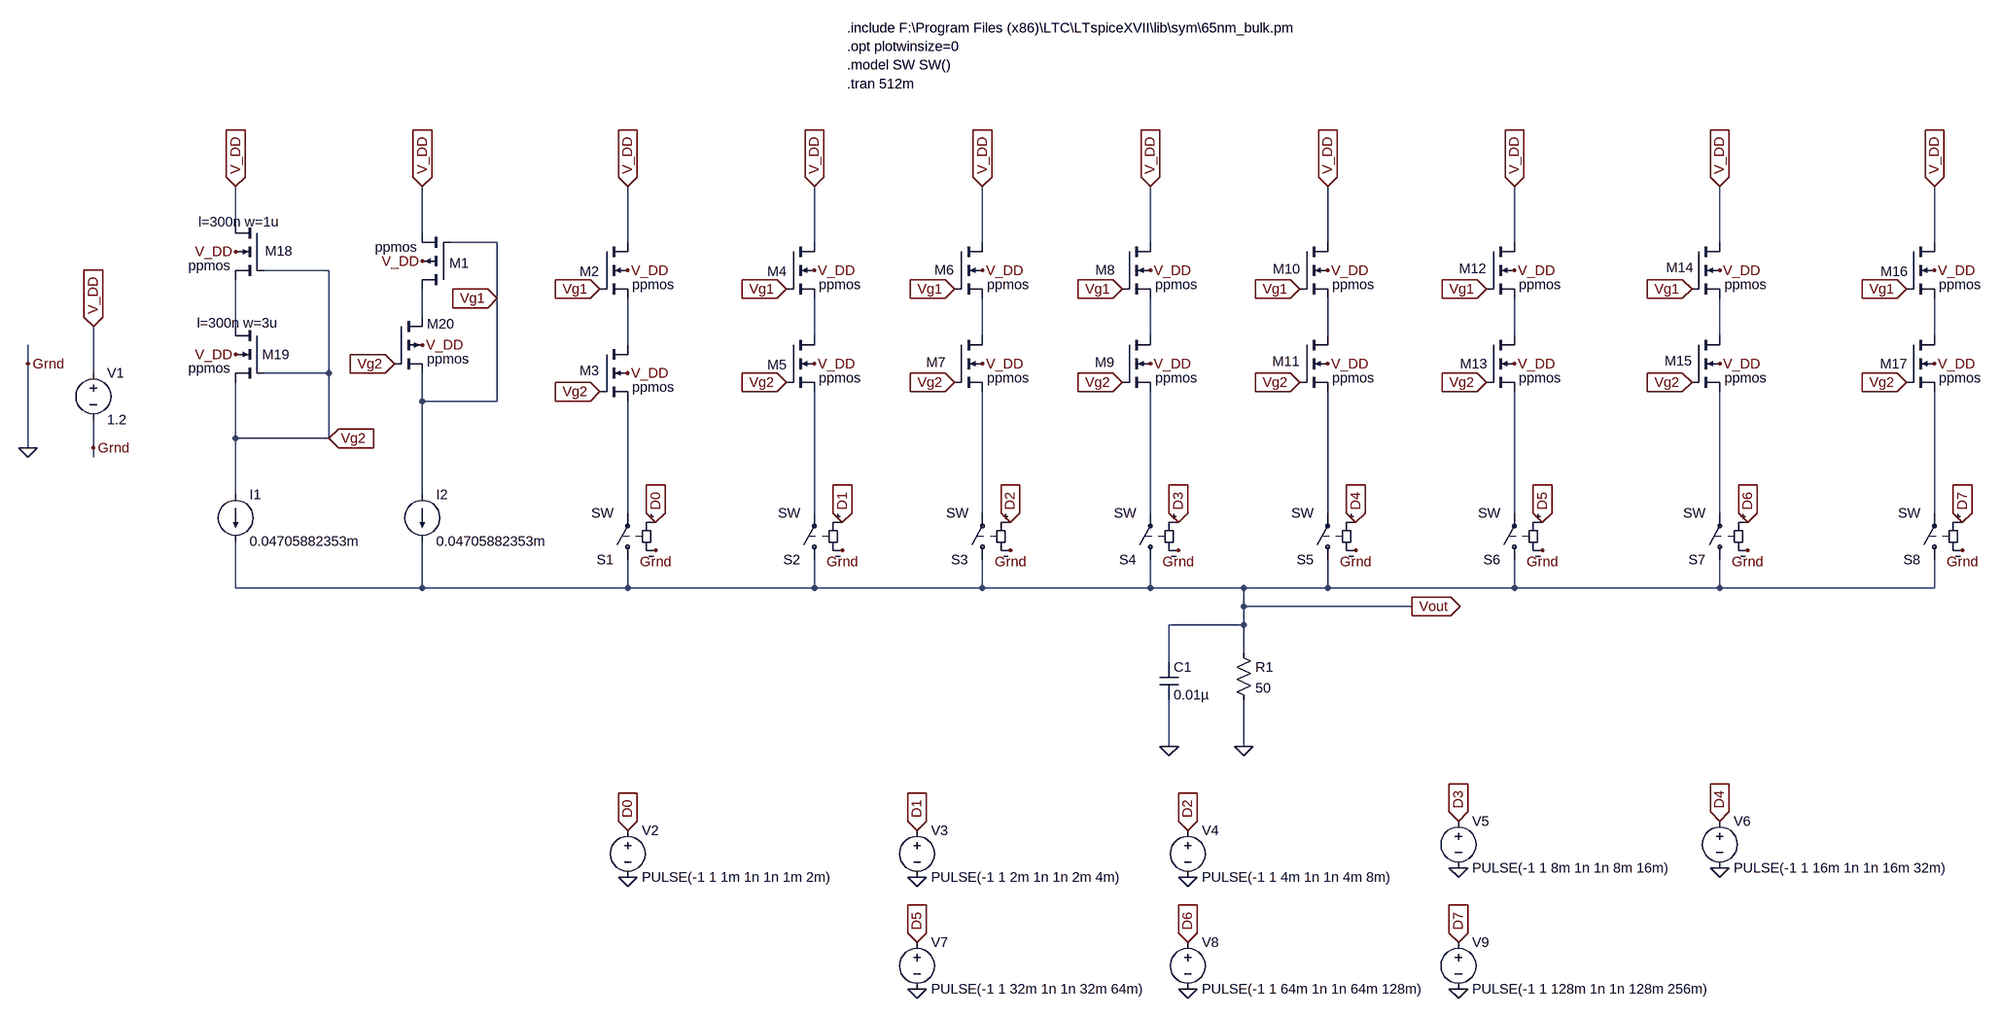
[diagram p0: schematic DAC_Sooch_Cascode_PMOS.asc]
DAC_Sooch_Cascode_PMOS.asc, the LTspice schematic file:
Version 4
SHEET 1 1724 868
WIRE -1328 -464 -1328 -528
WIRE -1008 -448 -1008 -528
WIRE -880 -432 -960 -432
WIRE -656 -432 -656 -528
WIRE -336 -432 -336 -528
WIRE -48 -432 -48 -528
WIRE 240 -432 240 -528
WIRE 544 -432 544 -528
WIRE 864 -432 864 -528
WIRE 1216 -432 1216 -528
WIRE 1584 -432 1584 -528
WIRE -1168 -384 -1280 -384
WIRE -880 -336 -880 -432
WIRE -1008 -304 -1008 -352
WIRE -1328 -288 -1328 -368
WIRE -336 -272 -336 -336
WIRE -48 -272 -48 -336
WIRE 240 -272 240 -336
WIRE 544 -272 544 -336
WIRE 864 -272 864 -336
WIRE 1216 -272 1216 -336
WIRE 1584 -272 1584 -336
WIRE -656 -256 -656 -336
WIRE -1824 -224 -1824 -256
WIRE -1712 -208 -1712 -288
WIRE -1168 -208 -1168 -384
WIRE -1168 -208 -1280 -208
WIRE -1008 -160 -1008 -208
WIRE -880 -160 -880 -336
WIRE -880 -160 -1008 -160
WIRE -1328 -96 -1328 -192
WIRE -1168 -96 -1168 -208
WIRE -1168 -96 -1328 -96
WIRE -1824 -80 -1824 -224
WIRE -1712 -80 -1712 -128
WIRE -1712 -64 -1712 -80
WIRE -1328 0 -1328 -96
WIRE -1008 0 -1008 -160
WIRE -656 32 -656 -160
WIRE -336 32 -336 -176
WIRE -48 32 -48 -176
WIRE 240 32 240 -176
WIRE 544 32 544 -176
WIRE 864 32 864 -176
WIRE 1216 32 1216 -176
WIRE 1584 32 1584 -176
WIRE -1328 160 -1328 80
WIRE -1008 160 -1008 80
WIRE -1008 160 -1328 160
WIRE -656 160 -656 112
WIRE -656 160 -1008 160
WIRE -336 160 -336 112
WIRE -336 160 -656 160
WIRE -48 160 -48 112
WIRE -48 160 -336 160
WIRE 240 160 240 112
WIRE 240 160 -48 160
WIRE 400 160 240 160
WIRE 544 160 544 112
WIRE 544 160 400 160
WIRE 864 160 864 112
WIRE 864 160 544 160
WIRE 1216 160 1216 112
WIRE 1216 160 864 160
WIRE 1584 160 1584 112
WIRE 1584 160 1216 160
WIRE 400 192 400 160
WIRE 688 192 400 192
WIRE 400 224 400 192
WIRE 400 224 272 224
WIRE 400 272 400 224
WIRE 272 288 272 224
WIRE 272 432 272 352
WIRE 400 432 400 352
FLAG -1824 -80 0
FLAG -1824 -224 Grnd
FLAG -1712 -80 Grnd
FLAG -1712 -288 V_DD
IOPIN -1712 -288 In
FLAG -1328 -528 V_DD
IOPIN -1328 -528 In
FLAG -1008 -528 V_DD
IOPIN -1008 -528 In
FLAG 400 432 0
FLAG 272 432 0
FLAG 688 192 Vout
IOPIN 688 192 Out
FLAG -608 96 Grnd
FLAG -288 96 Grnd
FLAG 0 96 Grnd
FLAG 288 96 Grnd
FLAG 592 96 Grnd
FLAG 912 96 Grnd
FLAG 1264 96 Grnd
FLAG 1632 96 Grnd
FLAG -608 48 D0
IOPIN -608 48 In
FLAG -288 48 D1
IOPIN -288 48 In
FLAG 0 48 D2
IOPIN 0 48 In
FLAG 288 48 D3
IOPIN 288 48 In
FLAG 592 48 D4
IOPIN 592 48 In
FLAG 912 48 D5
IOPIN 912 48 In
FLAG 1264 48 D6
IOPIN 1264 48 In
FLAG 1632 48 D7
IOPIN 1632 48 In
FLAG -656 656 0
FLAG -656 576 D0
IOPIN -656 576 In
FLAG -160 656 0
FLAG -160 576 D1
IOPIN -160 576 In
FLAG 304 656 0
FLAG 304 576 D2
IOPIN 304 576 In
FLAG 768 640 0
FLAG 768 560 D3
IOPIN 768 560 In
FLAG 1216 640 0
FLAG 1216 560 D4
IOPIN 1216 560 In
FLAG -160 848 0
FLAG -160 768 D5
IOPIN -160 768 In
FLAG 304 848 0
FLAG 304 768 D6
IOPIN 304 768 In
FLAG 768 848 0
FLAG 768 768 D7
IOPIN 768 768 In
FLAG -656 -528 V_DD
IOPIN -656 -528 In
FLAG -336 -528 V_DD
IOPIN -336 -528 In
FLAG -48 -528 V_DD
IOPIN -48 -528 In
FLAG 240 -528 V_DD
IOPIN 240 -528 In
FLAG 544 -528 V_DD
IOPIN 544 -528 In
FLAG 864 -528 V_DD
IOPIN 864 -528 In
FLAG 1216 -528 V_DD
IOPIN 1216 -528 In
FLAG 1584 -528 V_DD
IOPIN 1584 -528 In
FLAG -656 -384 V_DD
FLAG -336 -384 V_DD
FLAG -48 -384 V_DD
FLAG 240 -384 V_DD
FLAG 544 -384 V_DD
FLAG 864 -384 V_DD
FLAG -656 -208 V_DD
FLAG -336 -224 V_DD
FLAG -48 -224 V_DD
FLAG 240 -224 V_DD
FLAG 544 -224 V_DD
FLAG 864 -224 V_DD
FLAG -1328 -416 V_DD
FLAG -1328 -240 V_DD
FLAG -704 -352 Vg1
IOPIN -704 -352 In
FLAG -384 -352 Vg1
IOPIN -384 -352 In
FLAG -96 -352 Vg1
IOPIN -96 -352 In
FLAG 192 -352 Vg1
IOPIN 192 -352 In
FLAG 496 -352 Vg1
IOPIN 496 -352 In
FLAG 816 -352 Vg1
IOPIN 816 -352 In
FLAG 1168 -352 Vg1
IOPIN 1168 -352 In
FLAG -704 -176 Vg2
IOPIN -704 -176 In
FLAG -384 -192 Vg2
IOPIN -384 -192 In
FLAG -96 -192 Vg2
IOPIN -96 -192 In
FLAG 192 -192 Vg2
IOPIN 192 -192 In
FLAG 496 -192 Vg2
IOPIN 496 -192 In
FLAG 816 -192 Vg2
IOPIN 816 -192 In
FLAG 1168 -192 Vg2
IOPIN 1168 -192 In
FLAG 1536 -192 Vg2
IOPIN 1536 -192 In
FLAG 1536 -352 Vg1
IOPIN 1536 -352 In
FLAG 1216 -384 V_DD
FLAG 1216 -224 V_DD
FLAG 1584 -224 V_DD
FLAG 1584 -384 V_DD
FLAG -1168 -96 Vg2
IOPIN -1168 -96 In
FLAG -1008 -400 V_DD
FLAG -1008 -256 V_DD
FLAG -880 -336 Vg1
IOPIN -880 -336 In
FLAG -1056 -224 Vg2
IOPIN -1056 -224 In
SYMBOL voltage -1712 -224 R0
WINDOW 123 0 0 Left 0
WINDOW 39 0 0 Left 0
SYMATTR InstName V1
SYMATTR Value 1.2
SYMBOL nmos4 -704 -432 R0
WINDOW 0 -34 50 Left 2
SYMATTR InstName M2
SYMATTR Value ppmos
SYMATTR Value2 l=300n w=3u
SYMBOL nmos4 -704 -256 R0
WINDOW 0 -34 44 Left 2
SYMATTR InstName M3
SYMATTR Value ppmos
SYMATTR Value2 l=300n w=3u
SYMBOL nmos4 -384 -432 R0
WINDOW 0 -33 50 Left 2
SYMATTR InstName M4
SYMATTR Value ppmos
SYMATTR Value2 l=300n w=3u m=2
SYMBOL nmos4 -384 -272 R0
WINDOW 0 -33 50 Left 2
SYMATTR InstName M5
SYMATTR Value ppmos
SYMATTR Value2 l=300n w=3u m=2
SYMBOL nmos4 -96 -432 R0
WINDOW 0 -34 47 Left 2
SYMATTR InstName M6
SYMATTR Value ppmos
SYMATTR Value2 l=300n w=3u m=4
SYMBOL nmos4 -96 -272 R0
WINDOW 0 -48 46 Left 2
SYMATTR InstName M7
SYMATTR Value ppmos
SYMATTR Value2 l=300n w=3u m=4
SYMBOL nmos4 192 -432 R0
WINDOW 0 -46 47 Left 2
SYMATTR InstName M8
SYMATTR Value ppmos
SYMATTR Value2 l=300n w=3u m=8
SYMBOL nmos4 192 -272 R0
WINDOW 0 -47 46 Left 2
SYMATTR InstName M9
SYMATTR Value ppmos
SYMATTR Value2 l=300n w=3u m=8
SYMBOL nmos4 496 -432 R0
WINDOW 0 -46 46 Left 2
SYMATTR InstName M10
SYMATTR Value ppmos
SYMATTR Value2 l=300n w=3u m=16
SYMBOL nmos4 496 -272 R0
WINDOW 0 -47 44 Left 2
SYMATTR InstName M11
SYMATTR Value ppmos
SYMATTR Value2 l=300n w=3u m=16
SYMBOL nmos4 816 -432 R0
WINDOW 0 -47 45 Left 2
SYMATTR InstName M12
SYMATTR Value ppmos
SYMATTR Value2 l=300n w=3u m=32
SYMBOL nmos4 816 -272 R0
WINDOW 0 -45 48 Left 2
SYMATTR InstName M13
SYMATTR Value ppmos
SYMATTR Value2 l=300n w=3u m=32
SYMBOL nmos4 1168 -432 R0
WINDOW 0 -44 43 Left 2
SYMATTR InstName M14
SYMATTR Value ppmos
SYMATTR Value2 l=300n w=3u m=64
SYMBOL nmos4 1168 -272 R0
WINDOW 0 -46 43 Left 2
SYMATTR InstName M15
SYMATTR Value ppmos
SYMATTR Value2 l=300n w=3u m=64
SYMBOL nmos4 1536 -432 R0
WINDOW 0 -44 50 Left 2
SYMATTR InstName M16
SYMATTR Value ppmos
SYMATTR Value2 l=300n w=3u m=128
SYMBOL nmos4 1536 -272 R0
WINDOW 0 -45 48 Left 2
SYMATTR InstName M17
SYMATTR Value ppmos
SYMATTR Value2 l=300n w=3u m=128
SYMBOL nmos4 -1280 -464 M0
WINDOW 0 -50 47 Left 2
WINDOW 123 -27 -3 Left 2
SYMATTR InstName M18
SYMATTR Value2 l=300n w=1u
SYMATTR Value ppmos
SYMBOL nmos4 -1280 -288 M0
WINDOW 0 -45 48 Left 2
WINDOW 123 -25 -6 Left 2
SYMATTR InstName M19
SYMATTR Value2 l=300n w=3u
SYMATTR Value ppmos
SYMBOL sw -656 128 R180
SYMATTR InstName S1
SYMBOL sw -336 128 R180
SYMATTR InstName S2
SYMBOL sw -48 128 R180
SYMATTR InstName S3
SYMBOL sw 240 128 R180
SYMATTR InstName S4
SYMBOL sw 544 128 R180
SYMATTR InstName S5
SYMBOL sw 864 128 R180
SYMATTR InstName S6
SYMBOL sw 1216 128 R180
SYMATTR InstName S7
SYMBOL sw 1584 128 R180
SYMATTR InstName S8
SYMBOL res 384 256 R0
SYMATTR InstName R1
SYMATTR Value 50
SYMBOL cap 256 288 R0
SYMATTR InstName C1
SYMATTR Value 0.01µ
SYMBOL voltage -656 560 R0
WINDOW 123 0 0 Left 0
WINDOW 39 0 0 Left 0
SYMATTR InstName V2
SYMATTR Value PULSE(-1 1 1m 1n 1n 1m 2m)
SYMBOL voltage -160 560 R0
WINDOW 123 0 0 Left 0
WINDOW 39 0 0 Left 0
SYMATTR InstName V3
SYMATTR Value PULSE(-1 1 2m 1n 1n 2m 4m)
SYMBOL voltage 304 560 R0
WINDOW 123 0 0 Left 0
WINDOW 39 0 0 Left 0
SYMATTR InstName V4
SYMATTR Value PULSE(-1 1 4m 1n 1n 4m 8m)
SYMBOL voltage 768 544 R0
WINDOW 123 0 0 Left 0
WINDOW 39 0 0 Left 0
SYMATTR InstName V5
SYMATTR Value PULSE(-1 1 8m 1n 1n 8m 16m)
SYMBOL voltage 1216 544 R0
WINDOW 123 0 0 Left 0
WINDOW 39 0 0 Left 0
SYMATTR InstName V6
SYMATTR Value PULSE(-1 1 16m 1n 1n 16m 32m)
SYMBOL voltage -160 752 R0
WINDOW 123 0 0 Left 0
WINDOW 39 0 0 Left 0
SYMATTR InstName V7
SYMATTR Value PULSE(-1 1 32m 1n 1n 32m 64m)
SYMBOL voltage 304 752 R0
WINDOW 123 0 0 Left 0
WINDOW 39 0 0 Left 0
SYMATTR InstName V8
SYMATTR Value PULSE(-1 1 64m 1n 1n 64m 128m)
SYMBOL voltage 768 752 R0
WINDOW 123 0 0 Left 0
WINDOW 39 0 0 Left 0
SYMATTR InstName V9
SYMATTR Value PULSE(-1 1 128m 1n 1n 128m 256m)
SYMBOL pmos4 -960 -352 R180
WINDOW 0 -32 44 Left 2
SYMATTR InstName M1
SYMATTR Value ppmos
SYMATTR Value2 l=300n w=3u
SYMBOL pmos4 -1056 -304 R0
WINDOW 0 56 12 Left 2
SYMATTR InstName M20
SYMATTR Value ppmos
SYMATTR Value2 l=300n w=3u
SYMBOL current -1328 0 R0
WINDOW 123 0 0 Left 0
WINDOW 39 0 0 Left 0
SYMATTR InstName I1
SYMATTR Value 0.04705882353m
SYMBOL current -1008 0 R0
WINDOW 123 0 0 Left 0
WINDOW 39 0 0 Left 0
SYMATTR InstName I2
SYMATTR Value 0.04705882353m
TEXT -280 -800 Left 2 !.include F:\\Program Files (x86)\\LTC\\LTspiceXVII\\lib\\sym\\65nm_bulk.pm
TEXT -280 -768 Left 2 !.opt plotwinsize=0
TEXT -280 -736 Left 2 !.model SW SW()
TEXT -280 -704 Left 2 !.tran 512m

The netlist it stands for:
* DAC_Sooch_Cascode_PMOS.asc
V1 V_DD 0 1.2
M2 V_DD Vg1 N010 V_DD ppmos l=300n w=3u
M3 N010 Vg2 N011 V_DD ppmos l=300n w=3u
M4 V_DD Vg1 N003 V_DD ppmos l=300n w=3u m=2
M5 N003 Vg2 N012 V_DD ppmos l=300n w=3u m=2
M6 V_DD Vg1 N004 V_DD ppmos l=300n w=3u m=4
M7 N004 Vg2 N013 V_DD ppmos l=300n w=3u m=4
M8 V_DD Vg1 N005 V_DD ppmos l=300n w=3u m=8
M9 N005 Vg2 N014 V_DD ppmos l=300n w=3u m=8
M10 V_DD Vg1 N006 V_DD ppmos l=300n w=3u m=16
M11 N006 Vg2 N015 V_DD ppmos l=300n w=3u m=16
M12 V_DD Vg1 N007 V_DD ppmos l=300n w=3u m=32
M13 N007 Vg2 N016 V_DD ppmos l=300n w=3u m=32
M14 V_DD Vg1 N008 V_DD ppmos l=300n w=3u m=64
M15 N008 Vg2 N017 V_DD ppmos l=300n w=3u m=64
M16 V_DD Vg1 N009 V_DD ppmos l=300n w=3u m=128
M17 N009 Vg2 N018 V_DD ppmos l=300n w=3u m=128
M18 V_DD Vg2 N002 V_DD ppmos l=300n w=1u
M19 N002 Vg2 Vg2 V_DD ppmos l=300n w=3u
S1 Vout N011 D0 0 SW
S2 Vout N012 D1 0 SW
S3 Vout N013 D2 0 SW
S4 Vout N014 D3 0 SW
S5 Vout N015 D4 0 SW
S6 Vout N016 D5 0 SW
S7 Vout N017 D6 0 SW
S8 Vout N018 D7 0 SW
R1 Vout 0 50
C1 Vout 0 0.01µ
V2 D0 0 PULSE(-1 1 1m 1n 1n 1m 2m)
V3 D1 0 PULSE(-1 1 2m 1n 1n 2m 4m)
V4 D2 0 PULSE(-1 1 4m 1n 1n 4m 8m)
V5 D3 0 PULSE(-1 1 8m 1n 1n 8m 16m)
V6 D4 0 PULSE(-1 1 16m 1n 1n 16m 32m)
V7 D5 0 PULSE(-1 1 32m 1n 1n 32m 64m)
V8 D6 0 PULSE(-1 1 64m 1n 1n 64m 128m)
V9 D7 0 PULSE(-1 1 128m 1n 1n 128m 256m)
M1 N001 Vg1 V_DD V_DD ppmos l=300n w=3u
M20 N001 Vg2 Vg1 V_DD ppmos l=300n w=3u
I1 Vg2 Vout 0.04705882353m
I2 Vg1 Vout 0.04705882353m
.model NMOS NMOS
.model PMOS PMOS
.lib standard.mos
.include F:\Program Files (x86)\LTC\LTspiceXVII\lib\sym\65nm_bulk.pm
.opt plotwinsize=0
.model SW SW()
.tran 512m
.backanno
.end